# EAGLE design dabl_card_reader (EAGLE 8.6.2)
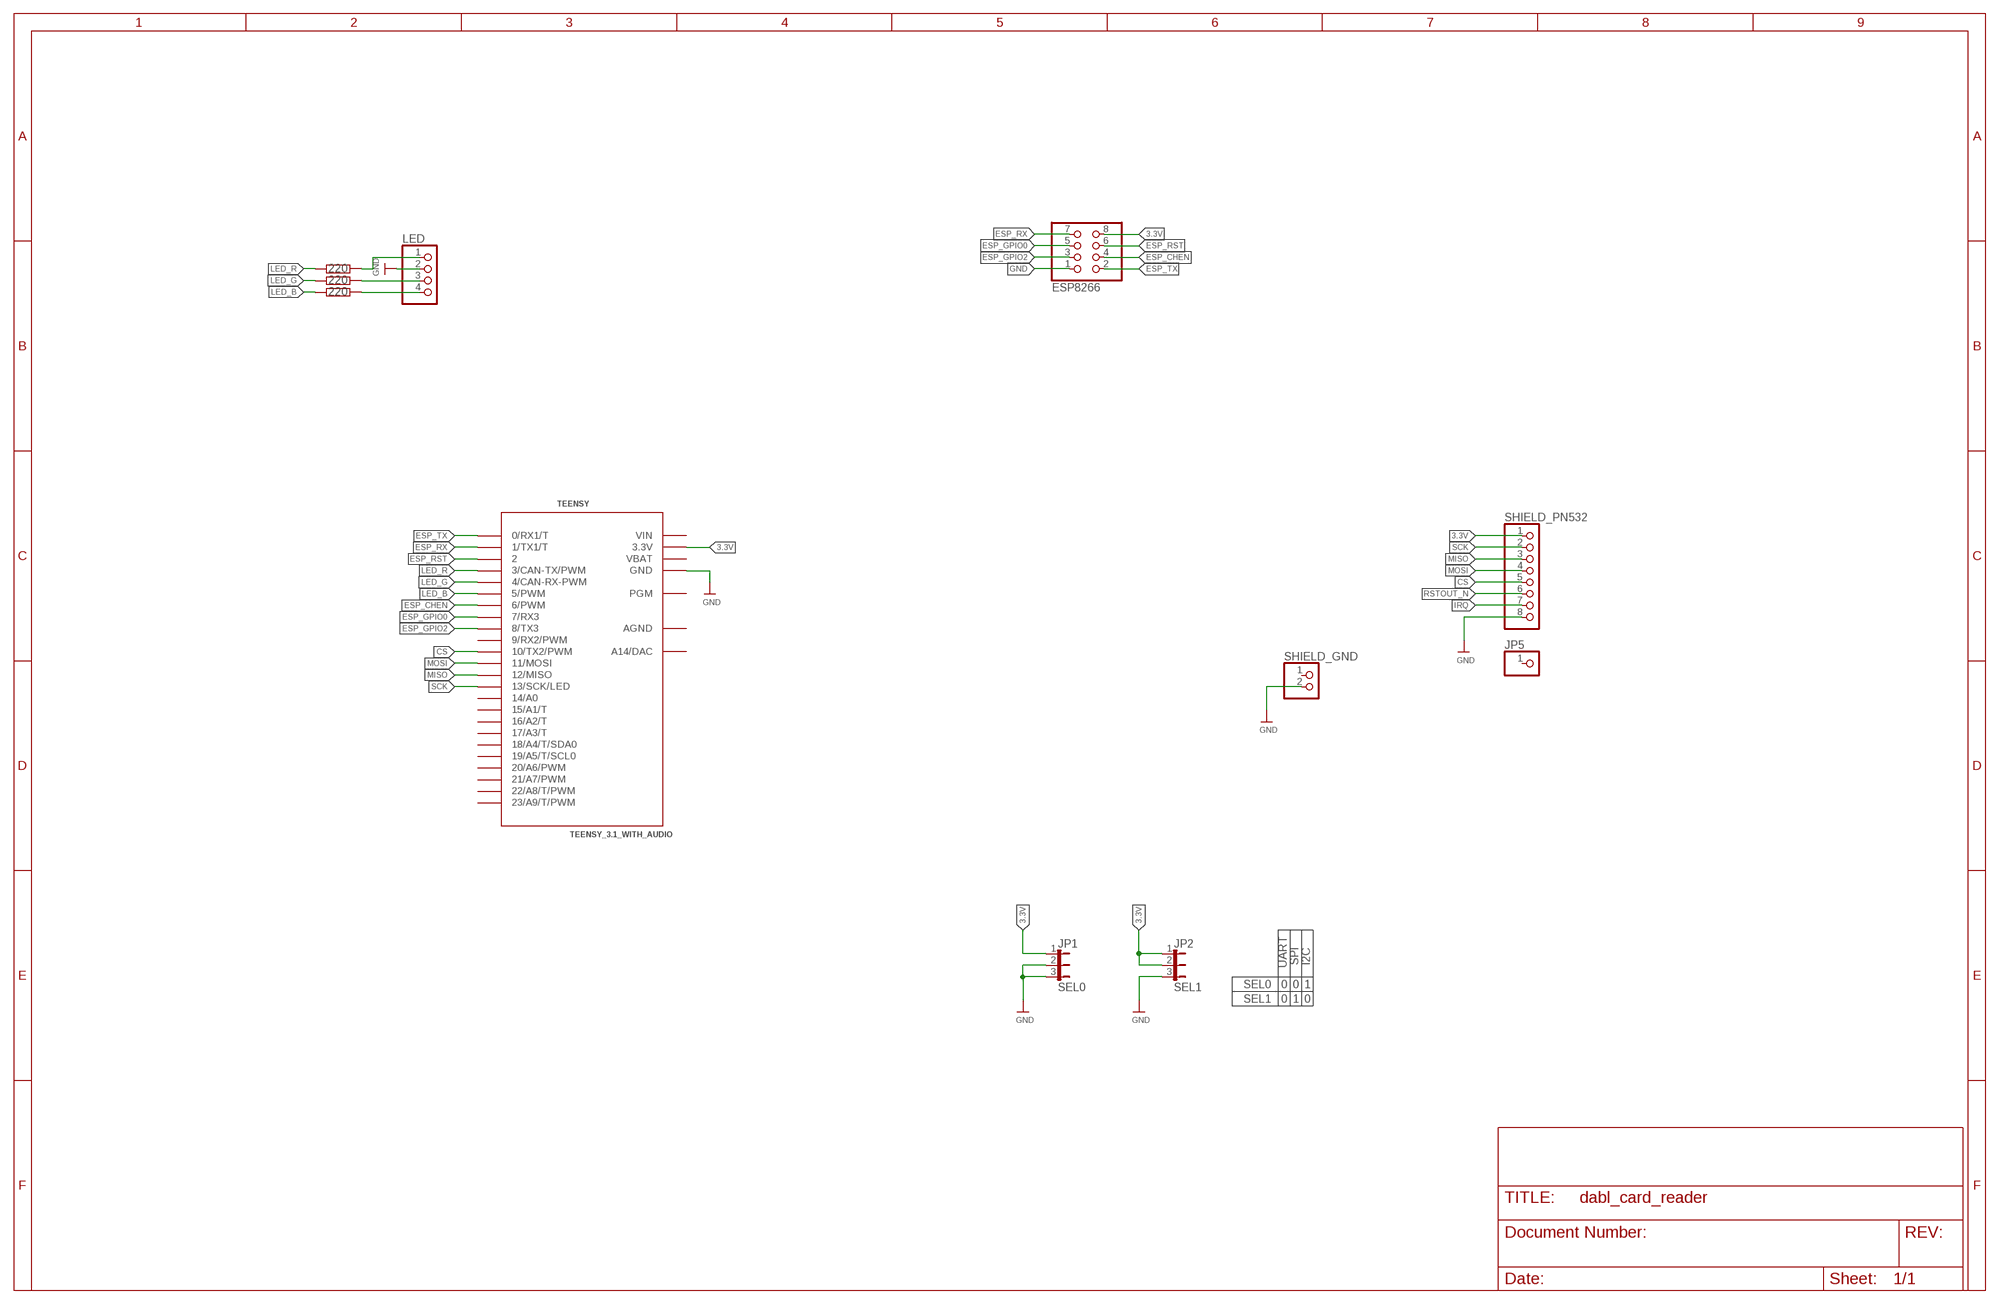
[diagram p0: schematic, sheet 1]

## Parts
ESP8266  PINHD-2X4  [2X04]
JP1  SEL0  JUMPER3  [JUMPER3]
JP2  SEL1  JUMPER3  [JUMPER3]
JP5  HEADER-1X1ROUND  [1X01_ROUND]
LED  PINHD-1X4  [1X04]
R1  220  R-EU_M0805  [M0805]
R2  220  R-EU_M0805  [M0805]
R3  220  R-EU_M0805  [M0805]
SHIELD_GND  PINHD-1X2  [1X02]
SHIELD_PN532  HEADER-1X8ROUND  [1X08_ROUND]
TEENSY  TEENSY_3.1_WITH_AUDIO  [TEENSY_3.2_WITH_AUDIO]

## Nets
3.3V: ESP8266.8 JP1.1 JP2.1 JP2.2 SHIELD_PN532.1 TEENSY.3.3V TEENSY.3.3V1(3.3V)
CS: SHIELD_PN532.5 TEENSY.10(10/TX2/PWM)
ESP_CHEN: ESP8266.4 TEENSY.6(6/PWM)
ESP_GPIO0: ESP8266.5 TEENSY.7(7/RX3)
ESP_GPIO2: ESP8266.3 TEENSY.8(8/TX3)
ESP_RST: ESP8266.6 TEENSY.2
ESP_RX: ESP8266.7 TEENSY.1(1/TX1/T)
ESP_TX: ESP8266.2 TEENSY.0(0/RX1/T)
GND: ESP8266.1 JP1.2 JP1.3 JP2.3 LED.2 SHIELD_GND.2 SHIELD_PN532.8 TEENSY.GND TEENSY.GND1(GND)
IRQ: SHIELD_PN532.7
LED_B: R3.2 TEENSY.5(5/PWM)
LED_G: R2.2 TEENSY.4(4/CAN-RX-PWM)
LED_R: R1.2 TEENSY.3(3/CAN-TX/PWM)
MISO: SHIELD_PN532.3 TEENSY.12(12/MISO)
MOSI: SHIELD_PN532.4 TEENSY.11(11/MOSI)
N$1: LED.4 R3.1
N$2: LED.3 R2.1
N$5: LED.1 R1.1
RSTOUT_N: SHIELD_PN532.6
SCK: SHIELD_PN532.2 TEENSY.13(13/SCK/LED)
Unconnected: JP5.1 SHIELD_GND.1 TEENSY.9(9/RX2/PWM) TEENSY.14/A0 TEENSY.15/A1(15/A1/T) TEENSY.16/A2(16/A2/T) TEENSY.17/A3(17/A3/T) TEENSY.18/A4(18/A4/T/SDA0) TEENSY.19/A5(19/A5/T/SCL0) TEENSY.20/A6(20/A6/PWM) TEENSY.21/A7(21/A7/PWM) TEENSY.22/A8(22/A8/T/PWM) TEENSY.23/A9(23/A9/T/PWM) TEENSY.A14(A14/DAC) TEENSY.PGM

## Notes on the sheet
- UART | SPI | I2C
- SEL0 | 0 | 0 | 1
- SEL1 | 0 | 1 | 0

## Power pins joined to a net without a drawn wire
AGND: TEENSY.AGND
VBAT: TEENSY.VBAT
VIN: TEENSY.VIN

## Library data of the parts
ESP8266 = pinhead:PINHD-2X4: PIN HEADER
JP1 JP2 = microbuilder:JUMPER3: JUMPER - 3 Pins
JP5 = microbuilder:HEADER-1X1: PIN HEADER
LED = pinhead:PINHD-1X4: PIN HEADER
R1-R3 = resistor:R-EU_: RESISTOR, European symbol
SHIELD_GND = pinhead:PINHD-1X2: PIN HEADER
SHIELD_PN532 = microbuilder:HEADER-1X8: PIN HEADER
TEENSY = personal:TEENSY_3.1_WITH_AUDIO: Footprint for Teensy 3.1 board using all pin connections on the outer perimeter

## Board
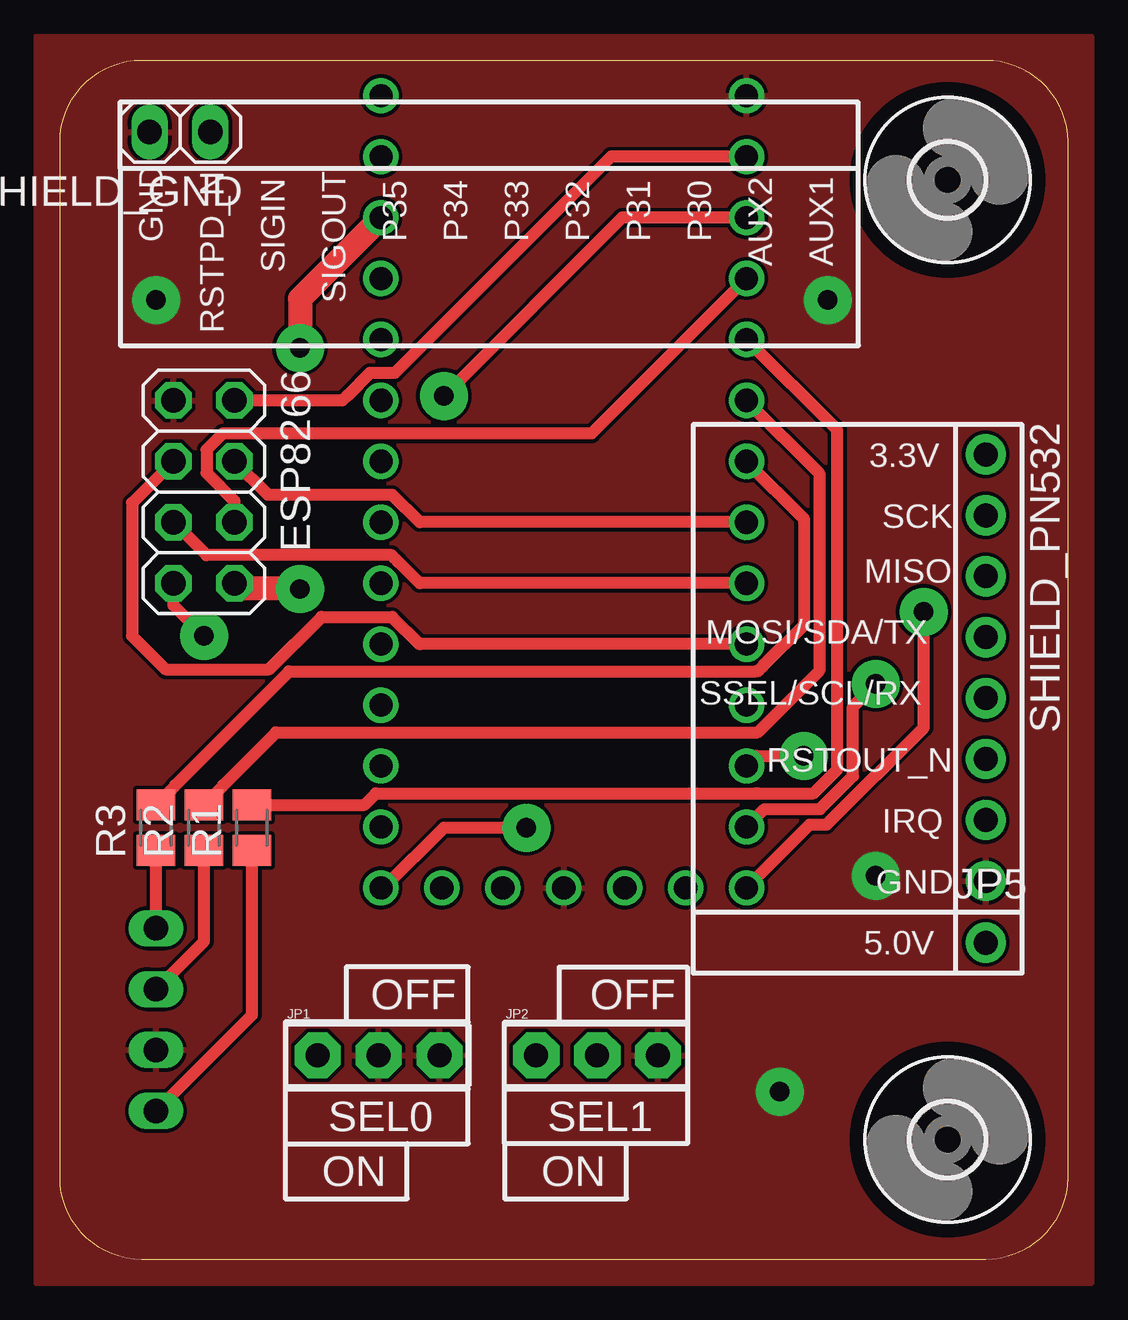
[diagram p1: board, top side]
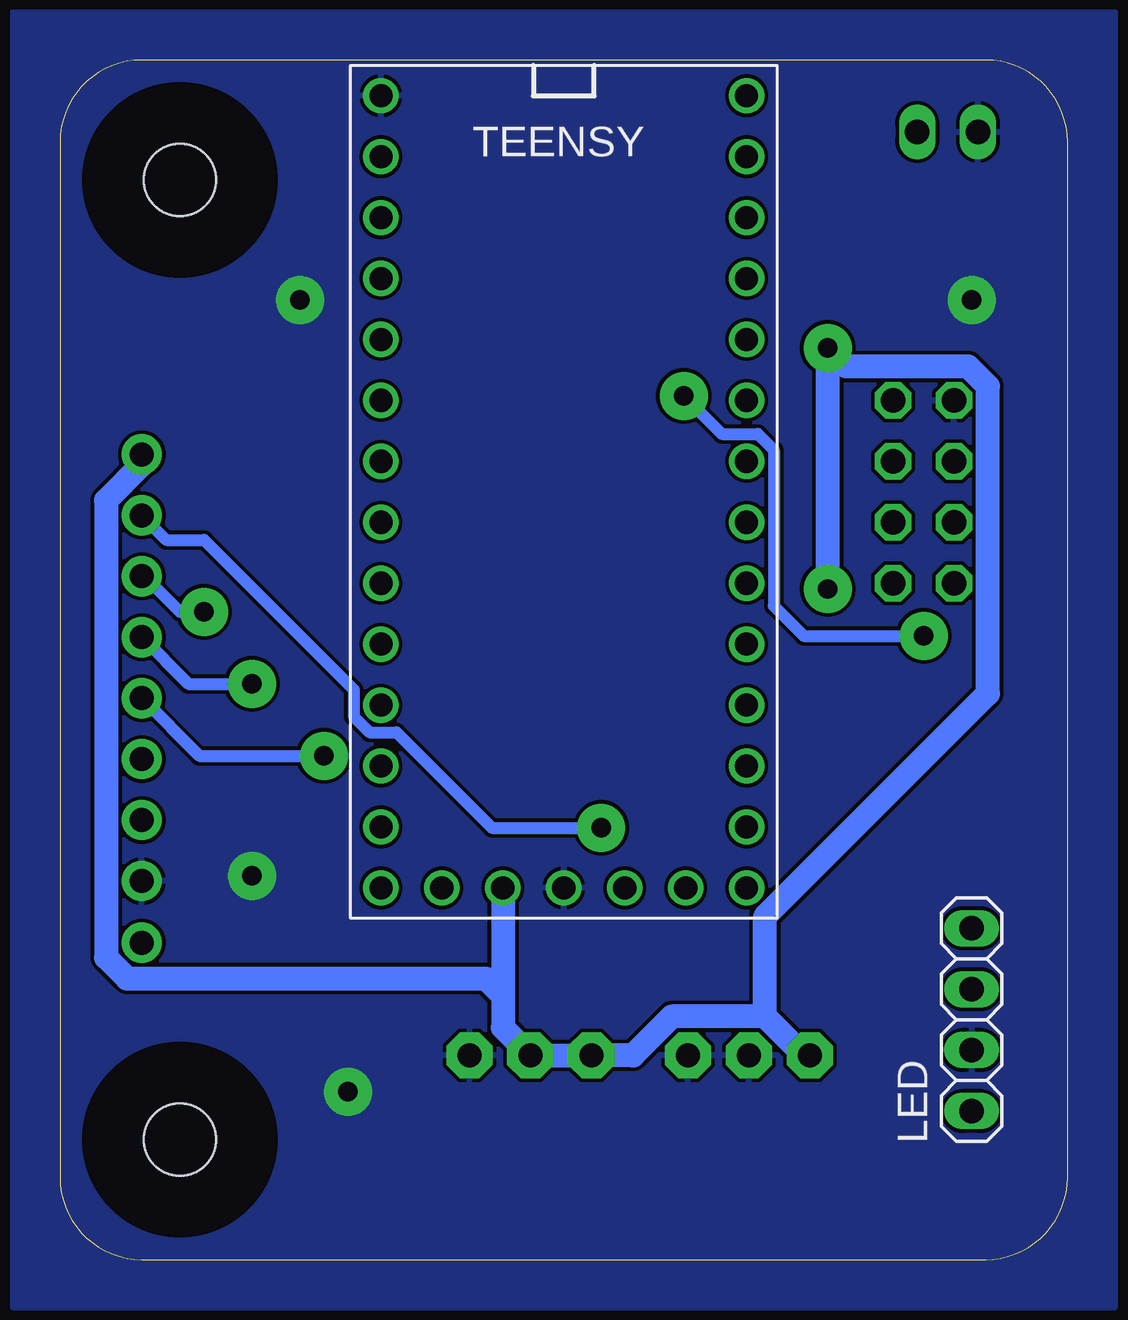
[diagram p2: board, bottom side, seen from below]

Size 42 x 50 mm. Coordinates in mm from the lower left corner, seen from the top.
Outline: 38.59,0 3.41,0 arc-90 0,3.41 0,46.59 arc-90 3.41,50 38.59,50 arc-90 42,46.59 42,3.41 arc-90 38.59,0
Copper layers (1*16): Top 0.035mm / dielectric 1.5mm / Bottom 0.035mm
Design rules "OthermillDRC_30_deg_v2": minimum track width 6mil, minimum drill 0.8mm, track to track 6mil, track to pad 6mil, pad to pad 6mil, via to via 6mil, smd to smd 0mil, copper to edge 0mil, drill to drill 6mil, minimum pad ring 10mil, minimum via ring 10mil, stop-mask expansion 1mil, vias tented up to drill 30mil, thermal gap 6mil

### Footprints (pad centres in the part's own frame; a part is rotated, then mirrored left to right if it is on the bottom)
2X04 = drill 1.016 octagon: 1 -3.81,-1.27; 2 -3.81,1.27; 3 -1.27,-1.27; 4 -1.27,1.27; 5 1.27,-1.27; 6 1.27,1.27; 7 3.81,-1.27; 8 3.81,1.27
JUMPER3 = drill 1 pad 1.93 octagon: 1 -2.54,0; 2 0,0; 3 2.54,0
1X01_ROUND = drill 1 pad 1.676: 1 0,0
1X04 = drill 1.016 long: 1 -3.81,0; 2 -1.27,0; 3 1.27,0; 4 3.81,0
M0805 = smd 1.3 x 1.6: 1 -0.95,0; 2 0.95,0
1X02 = drill 1.016 long: 1 -1.27,0; 2 1.27,0
1X08_ROUND = drill 1 pad 1.676: 1 -8.89,0; 2 -6.35,0; 3 -3.81,0; 4 -1.27,0; 5 1.27,0; 6 3.81,0; 7 6.35,0; 8 8.89,0
TEENSY_3.2_WITH_AUDIO = drill 0.965: 0 -7.62,13.97; 1 -7.62,11.43; 2 -7.62,8.89; 3 -7.62,6.35; 3.3V 7.62,11.43; 3.3V1 -2.54,-16.51; 4 -7.62,3.81; 5 -7.62,1.27; 6 -7.62,-1.27; 7 -7.62,-3.81; 8 -7.62,-6.35; 9 -7.62,-8.89; 10 -7.62,-11.43; 11 -7.62,-13.97; 12 -7.62,-16.51; 13 7.62,-16.51; 14/A0 7.62,-13.97; 15/A1 7.62,-11.43; 16/A2 7.62,-8.89; 17/A3 7.62,-6.35; 18/A4 7.62,-3.81; 19/A5 7.62,-1.27; 20/A6 7.62,1.27; 21/A7 7.62,3.81; 22/A8 7.62,6.35; 23/A9 7.62,8.89; A14 5.08,-16.51; AGND 7.62,13.97; GND -7.62,16.51; GND1 0,-16.51; PGM 2.54,-16.51; VBAT -5.08,-16.51; VIN 7.62,16.51
MOUNTINGHOLE_3.0 = hole 3: 0,0

### Placement (x,y rotation side)
ESP8266  6,32 270 top
JP1  13.28,8.51 0 top
JP2  22.39,8.51 0 top
JP5  38.59,13.21 0 top
LED  4,10 90 bottom
R1  8,18 90 top
R2  6,18 90 top
R3  4,18 90 top
SHIELD_GND  5,47 180 top
SHIELD_PN532  38.59,24.67 270 top
TEENSY  21,32 0 bottom
U$37  [MOUNTINGHOLE_3.0]  37,5 0 top
U$38  [MOUNTINGHOLE_3.0]  37,45 0 top

### Tracks (layer width: path | path; a pad name or v marks a point on that pad's centre or on a via)
3.3V  (via drill 0.8 pad 2)
  Top 1: TEENSY.3.3V 10,40.05 v10,38 | ESP8266.8 7.46,28 10,28 v10,27.95
  Bottom 1: TEENSY.3.3V1 23.54,11 | 23.54,11 23.54,9.66 JP2.2 JP2.1 18.11,8.51 16.49,10.13 12.61,10.13 | JP1.1 10.99,8.51 12.61,10.13 | 12.61,10.13 12.61,14.3 3.32,23.59 3.32,36.4 4.14,37.22 9.22,37.22 v10,38 v10,27.95 | SHIELD_PN532.1 38.59,33.13 40.08,31.64 40.08,12.59 39.21,11.72 24.26,11.72 23.54,11
CS  (via drill 0.8 pad 2)
  Top 0.5: TEENSY.10 29.05,21 v31,21
  Bottom 0.5: SHIELD_PN532.5 36.19,21 v31,21
ESP_CHEN
  Top 0.5: TEENSY.6 14.99,30.73 13.85,31.87 8.67,31.87 ESP8266.4
ESP_GPIO0
  Top 0.5: TEENSY.7 14.99,28.19 14.09,29.09 13.85,29.33 13.83,29.35 6.11,29.35 ESP8266.5
ESP_GPIO2
  Top 0.5: TEENSY.8 14.99,25.65 13.85,26.79 10.9,26.79 8.71,24.6 4.4,24.6 3,26 3,31.54 ESP8266.3
ESP_RST
  Top 0.5: TEENSY.2 22.16,34.43 6.79,34.43 6.11,33.75 6.11,32.79 7.27,31.62 ESP8266.6
ESP_RX  (via drill 0.8 pad 2)
  Top 0.5: TEENSY.1 23.43,43.43 v16,36 | v6,26 4.73,27.27 ESP8266.7
  Bottom 0.5: v16,36 14.41,34.41 12.91,34.41 12.24,33.74 12.24,27.24 11,26 v6,26
ESP_TX
  Top 0.5: TEENSY.0 22.97,45.97 13.95,36.95 12.91,36.95 11.98,36.02 11.77,35.81 ESP8266.2
GND  (via drill 0.8 pad 2)
  other vias: 34,16 30,7 4,40 32,40
  pour Top: -1,51 43,51 43,-1 -1,-1
  pour Bottom: -2,-2 -2,52 44,52 44,-2
LED_B
  Top 0.5: R3.2 4.8,19.75 4.8,19.77 9.54,24.51 29,24.51 29.09,24.51 29.29,24.71 31,26.42 31,30.89 TEENSY.5
LED_G
  Top 0.5: R2.2 6.8,19.75 6.8,19.77 9,21.97 29.09,21.97 31.65,24.53 31.65,32.78 TEENSY.4
LED_R
  Top 0.5: R1.2 12.69,18.95 13.17,19.43 29,19.43 29.09,19.43 31.41,19.43 32.4,20.42 32.4,34.57 TEENSY.3
MISO  (via drill 0.8 pad 2)
  Top 0.5: TEENSY.12 31.26,18.13 31.95,18.13 36,22.17 v36,27
  Bottom 0.5: SHIELD_PN532.3 38.48,28.48 37,27 v36,27
MOSI  (via drill 0.8 pad 2)
  Top 0.5: TEENSY.11 29.37,18.78 31.69,18.78 33.05,20.15 33.05,23.05 v34,24
  Bottom 0.5: SHIELD_PN532.4 36.65,24 v34,24
N$1
  Top 0.5: LED.4 R3.1
N$2
  Top 0.5: LED.3 6,13.27 R2.1
N$5
  Top 0.5: LED.1 8,10.19 R1.1
SCK  (via drill 0.8 pad 2)
  Top 0.5: TEENSY.13 13.49,15.49 16,18 v19.44,18
  Bottom 0.5: SHIELD_PN532.2 37.57,30 36,30 29.76,23.76 29.76,22.64 29.09,21.97 27.97,21.97 24,18 v19.44,18

### Text on the board
tPlace: GND | P35 | P34 | P33 | P32 | P31 | P30 | SIGIN | AUX2 | AUX1 | SIGOUT | RSTPD_N | 3.3V | SCK | MISO | MOSI/SDA/TX | SSEL/SCL/RX | RSTOUT_N | IRQ | GND | 5.0V | OFF | OFF | SEL0 | SEL1 | ON | ON